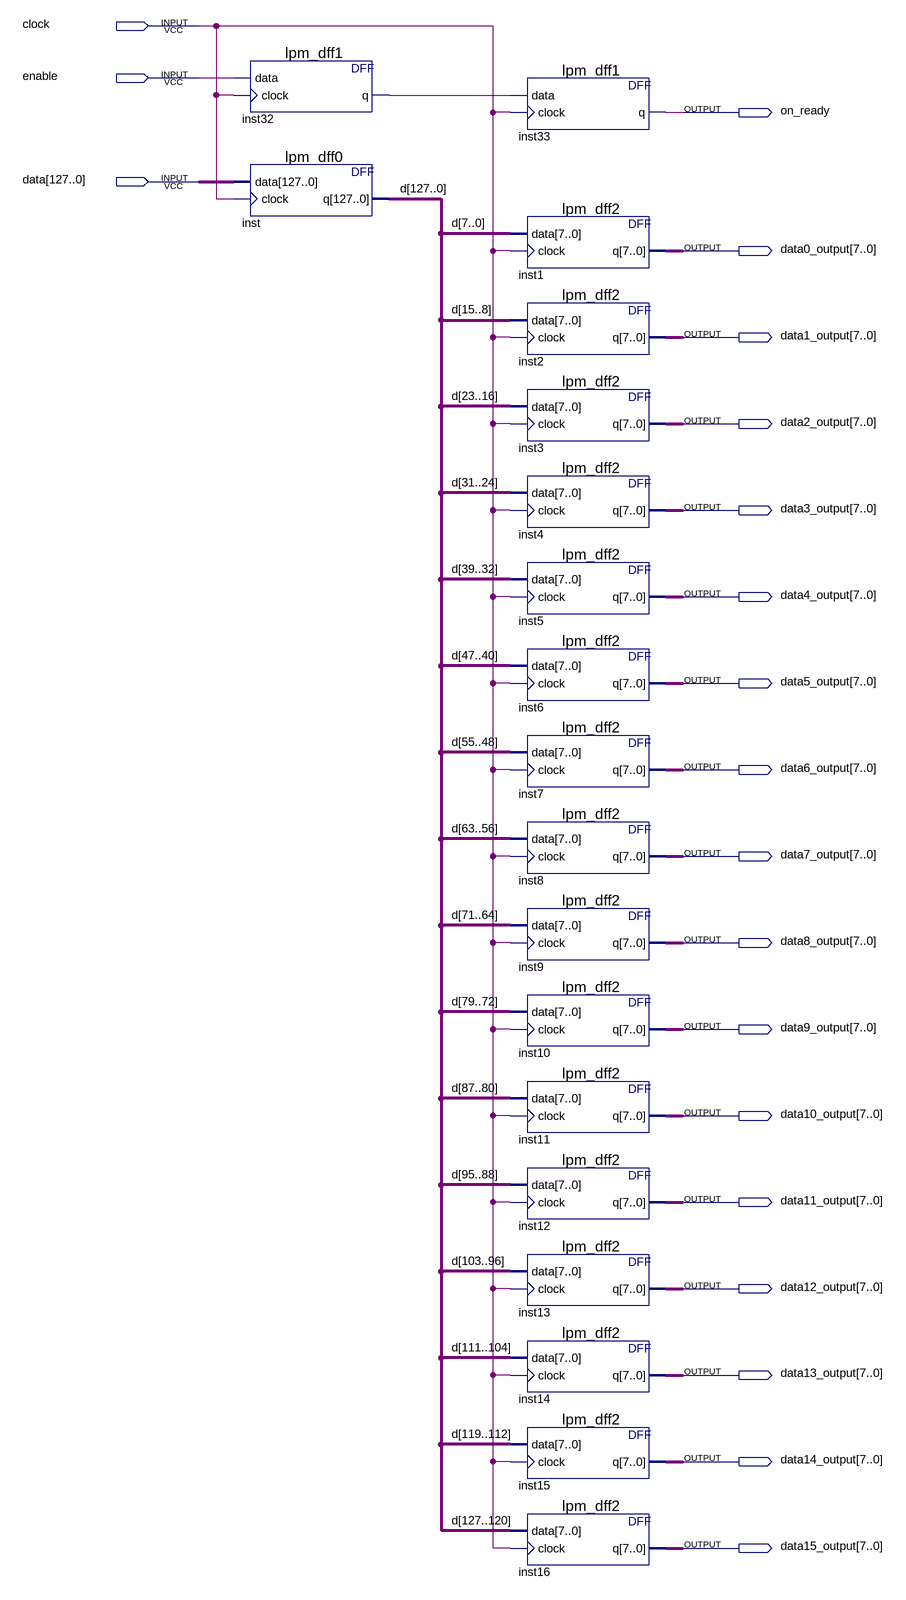
[diagram p0: schematic sheet]
// Quartus schematic 128bits_to_16bytes.bdf as structural Verilog: 19 symbols, 20 pins
module \128bits_to_16bytes  (
  input  clock,
  input  enable,
  input  [127:0] data,
  output on_ready,
  output [7:0] data0_output,
  output [7:0] data1_output,
  output [7:0] data2_output,
  output [7:0] data3_output,
  output [7:0] data4_output,
  output [7:0] data5_output,
  output [7:0] data6_output,
  output [7:0] data7_output,
  output [7:0] data8_output,
  output [7:0] data9_output,
  output [7:0] data10_output,
  output [7:0] data11_output,
  output [7:0] data12_output,
  output [7:0] data13_output,
  output [7:0] data14_output,
  output [7:0] data15_output
);

  wire inst32_q;
  wire [127:0] d;

  lpm_dff1 inst32 (.data(enable), .clock(clock), .q(inst32_q));
  lpm_dff0 inst (.data(data), .clock(clock), .q(d));
  lpm_dff1 inst33 (.data(inst32_q), .clock(clock), .q(on_ready));
  lpm_dff2 inst1 (.data(d[7:0]), .clock(clock), .q(data0_output));
  lpm_dff2 inst2 (.data(d[15:8]), .clock(clock), .q(data1_output));
  lpm_dff2 inst3 (.data(d[23:16]), .clock(clock), .q(data2_output));
  lpm_dff2 inst4 (.data(d[31:24]), .clock(clock), .q(data3_output));
  lpm_dff2 inst5 (.data(d[39:32]), .clock(clock), .q(data4_output));
  lpm_dff2 inst6 (.data(d[47:40]), .clock(clock), .q(data5_output));
  lpm_dff2 inst7 (.data(d[55:48]), .clock(clock), .q(data6_output));
  lpm_dff2 inst8 (.data(d[63:56]), .clock(clock), .q(data7_output));
  lpm_dff2 inst9 (.data(d[71:64]), .clock(clock), .q(data8_output));
  lpm_dff2 inst10 (.data(d[79:72]), .clock(clock), .q(data9_output));
  lpm_dff2 inst11 (.data(d[87:80]), .clock(clock), .q(data10_output));
  lpm_dff2 inst12 (.data(d[95:88]), .clock(clock), .q(data11_output));
  lpm_dff2 inst13 (.data(d[103:96]), .clock(clock), .q(data12_output));
  lpm_dff2 inst14 (.data(d[111:104]), .clock(clock), .q(data13_output));
  lpm_dff2 inst15 (.data(d[119:112]), .clock(clock), .q(data14_output));
  lpm_dff2 inst16 (.data(d[127:120]), .clock(clock), .q(data15_output));
endmodule
